# Altium schematic sheet PWR_TPS7A8300.SchDoc
size A3
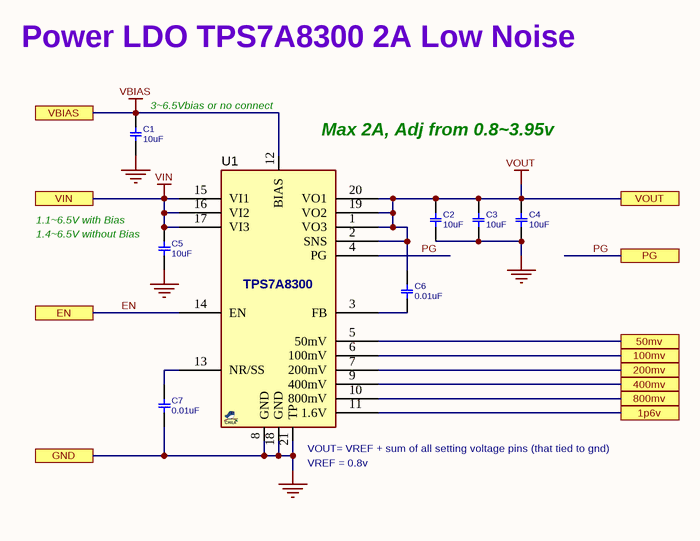
[diagram p0: PWR_TPS7A8300.SchDoc]

## Parts
C1  10uF  [C0402]
C2  10uF  [C0402]
C3  10uF  [C0402]
C4  10uF  [C0402]
C5  10uF  [C0402]
C6  0.01uF  [C0402]
C7  0.01uF  [C0402]
U1  TPS7A8300  [QFN65_20T]  (value not drawn)

## Ports
1p6v, 50mv, 100mv, 200mv, 400mv, 800mv, EN, GND, PG, VBIAS, VIN, VOUT

## Nets
GND: C1.2 C2.2 C3.2 C4.2 C5.2 C7.2 U1.8(GND) U1.18(GND) U1.21(TP) ; port GND
VBIAS: C1.1 U1.12(BIAS) ; port VBIAS
VIN: C5.1 U1.15(VI1) U1.16(VI2) U1.17(VI3) ; port VIN
VOUT: C2.1 C3.1 C4.1 C6.1 U1.1(VO3) U1.2(SNS) U1.19(VO2) U1.20(VO1) ; port VOUT
1p6v: U1.11(1.6V) ; port 1p6v
50mv: U1.5(50mV) ; port 50mv
100mv: U1.6(100mV) ; port 100mv
200mv: U1.7(200mV) ; port 200mv
400mv: U1.9(400mV) ; port 400mv
800mv: U1.10(800mV) ; port 800mv
EN: U1.14(EN) ; port EN
PG: U1.4(PG) ; port PG
NetC6_2: C6.2 U1.3(FB)
NetC7_1: C7.1 U1.13(NR/SS)

## Notes on the sheet
- Power LDO TPS7A8300 2A Low Noise
- (near C1) 3~6.5Vbias or no connect
- (near U1) Max 2A, Adj from 0.8~3.95v
- (near C5) 1.1~6.5V with Bias
- (near C5) 1.4~6.5V without Bias
- (near U1) VOUT= VREF + sum of all setting voltage pins (that tied to gnd)
- (near U1) VREF = 0.8v

## Library data of the parts
C1-C5 = CAP_SMD_MLCC_100n50T: CAP, MLCC; PARAM: 50V; PARAM2: X5R, 10%; MANF_P#: -; MANF: -; DESC: -; ASSEMBLY: ASSEMBLY; PRICE: 100= 5$; VALUE: 10uF
C6 C7 = CAP_SMD_MLCC: CAP, MLCC; MANF_P#: MANF_PART#; MANF: Murata; PARAM: -; PRICE: 100= 1$; PARAM2: -; ASSEMBLY: ASSEMBLY; VALUE: 0.01uF
U1 = VREG_TPS7A8300_QFN20: REG, Linear, LDO0.12V, 2A, QFN-20; PARAM2: 1.1~6.5Vin, 3~6.5Vbias; MANF: Texas Instruments; MANF_P#: TPS7A8300RGW; PARAM: LDO0.12V, 2A; VALUE: TPS7A8300